# Altium schematic sheet Sheet1.SchDoc
size A4; SheetNumber: 1; SheetTotal: 1
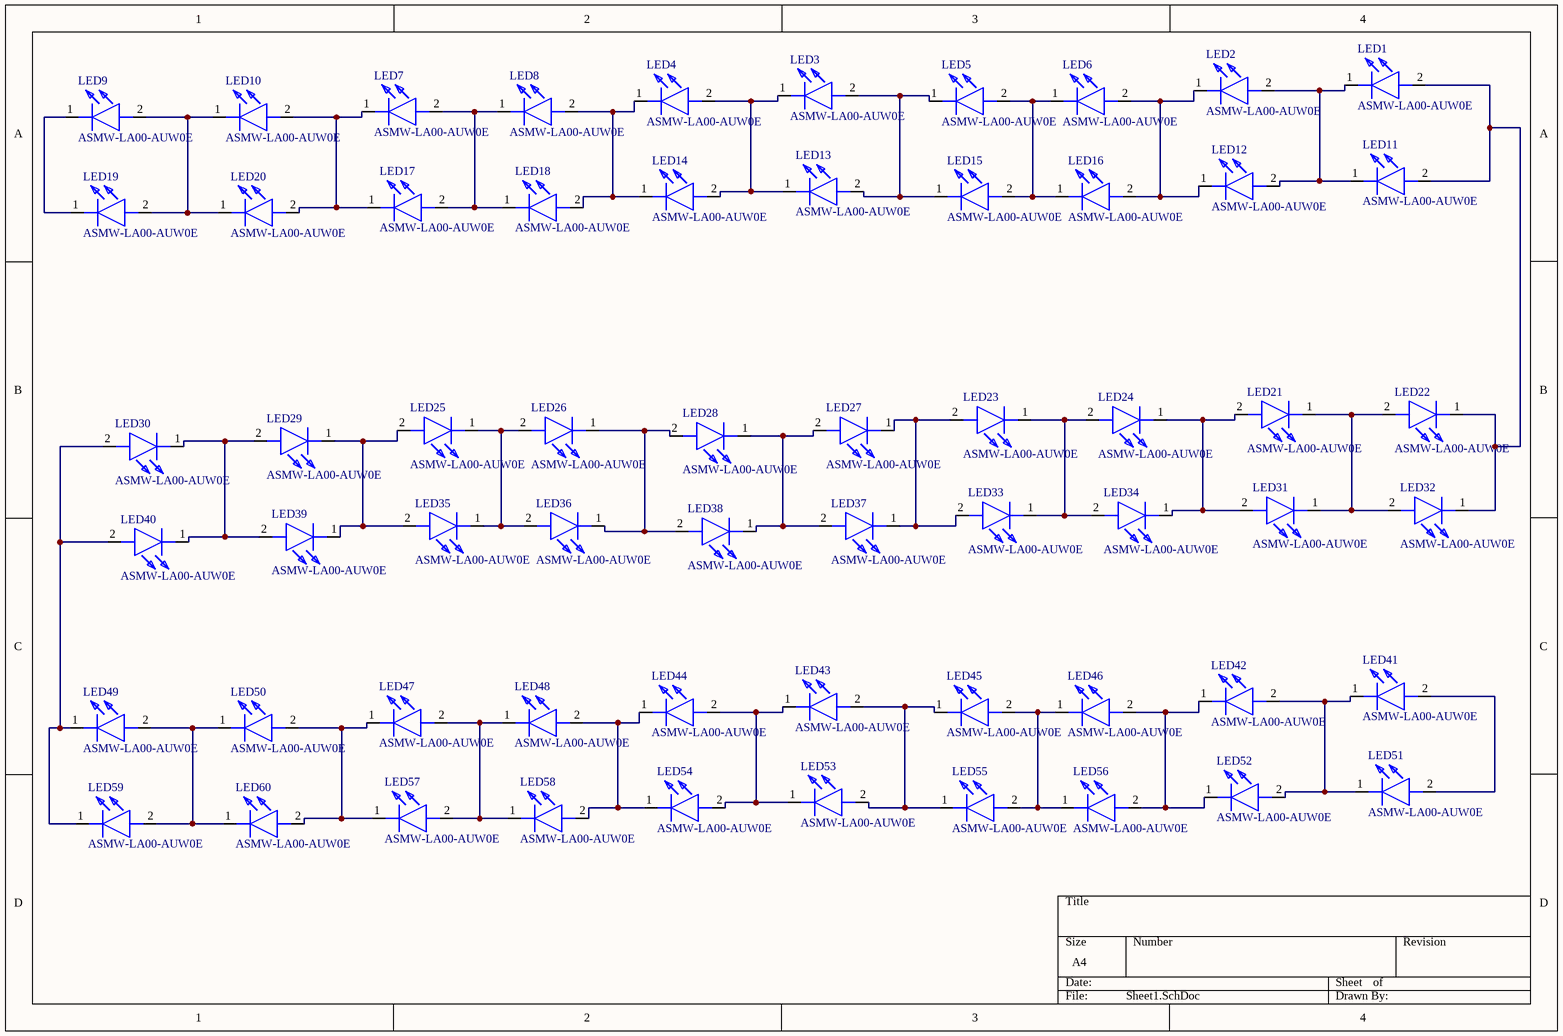
[diagram p0: Sheet1.SchDoc]

## Parts
LED1  ASMW-LA00-AUW0E  [ASMWLA00AUW0E]
LED2  ASMW-LA00-AUW0E  [ASMWLA00AUW0E]
LED3  ASMW-LA00-AUW0E  [ASMWLA00AUW0E]
LED4  ASMW-LA00-AUW0E  [ASMWLA00AUW0E]
LED5  ASMW-LA00-AUW0E  [ASMWLA00AUW0E]
LED6  ASMW-LA00-AUW0E  [ASMWLA00AUW0E]
LED7  ASMW-LA00-AUW0E  [ASMWLA00AUW0E]
LED8  ASMW-LA00-AUW0E  [ASMWLA00AUW0E]
LED9  ASMW-LA00-AUW0E  [ASMWLA00AUW0E]
LED10  ASMW-LA00-AUW0E  [ASMWLA00AUW0E]
LED11  ASMW-LA00-AUW0E  [ASMWLA00AUW0E]
LED12  ASMW-LA00-AUW0E  [ASMWLA00AUW0E]
LED13  ASMW-LA00-AUW0E  [ASMWLA00AUW0E]
LED14  ASMW-LA00-AUW0E  [ASMWLA00AUW0E]
LED15  ASMW-LA00-AUW0E  [ASMWLA00AUW0E]
LED16  ASMW-LA00-AUW0E  [ASMWLA00AUW0E]
LED17  ASMW-LA00-AUW0E  [ASMWLA00AUW0E]
LED18  ASMW-LA00-AUW0E  [ASMWLA00AUW0E]
LED19  ASMW-LA00-AUW0E  [ASMWLA00AUW0E]
LED20  ASMW-LA00-AUW0E  [ASMWLA00AUW0E]
LED21  ASMW-LA00-AUW0E  [ASMWLA00AUW0E]
LED22  ASMW-LA00-AUW0E  [ASMWLA00AUW0E]
LED23  ASMW-LA00-AUW0E  [ASMWLA00AUW0E]
LED24  ASMW-LA00-AUW0E  [ASMWLA00AUW0E]
LED25  ASMW-LA00-AUW0E  [ASMWLA00AUW0E]
LED26  ASMW-LA00-AUW0E  [ASMWLA00AUW0E]
LED27  ASMW-LA00-AUW0E  [ASMWLA00AUW0E]
LED28  ASMW-LA00-AUW0E  [ASMWLA00AUW0E]
LED29  ASMW-LA00-AUW0E  [ASMWLA00AUW0E]
LED30  ASMW-LA00-AUW0E  [ASMWLA00AUW0E]
LED31  ASMW-LA00-AUW0E  [ASMWLA00AUW0E]
LED32  ASMW-LA00-AUW0E  [ASMWLA00AUW0E]
LED33  ASMW-LA00-AUW0E  [ASMWLA00AUW0E]
LED34  ASMW-LA00-AUW0E  [ASMWLA00AUW0E]
LED35  ASMW-LA00-AUW0E  [ASMWLA00AUW0E]
LED36  ASMW-LA00-AUW0E  [ASMWLA00AUW0E]
LED37  ASMW-LA00-AUW0E  [ASMWLA00AUW0E]
LED38  ASMW-LA00-AUW0E  [ASMWLA00AUW0E]
LED39  ASMW-LA00-AUW0E  [ASMWLA00AUW0E]
LED40  ASMW-LA00-AUW0E  [ASMWLA00AUW0E]
LED41  ASMW-LA00-AUW0E  [ASMWLA00AUW0E]
LED42  ASMW-LA00-AUW0E  [ASMWLA00AUW0E]
LED43  ASMW-LA00-AUW0E  [ASMWLA00AUW0E]
LED44  ASMW-LA00-AUW0E  [ASMWLA00AUW0E]
LED45  ASMW-LA00-AUW0E  [ASMWLA00AUW0E]
LED46  ASMW-LA00-AUW0E  [ASMWLA00AUW0E]
LED47  ASMW-LA00-AUW0E  [ASMWLA00AUW0E]
LED48  ASMW-LA00-AUW0E  [ASMWLA00AUW0E]
LED49  ASMW-LA00-AUW0E  [ASMWLA00AUW0E]
LED50  ASMW-LA00-AUW0E  [ASMWLA00AUW0E]
LED51  ASMW-LA00-AUW0E  [ASMWLA00AUW0E]
LED52  ASMW-LA00-AUW0E  [ASMWLA00AUW0E]
LED53  ASMW-LA00-AUW0E  [ASMWLA00AUW0E]
LED54  ASMW-LA00-AUW0E  [ASMWLA00AUW0E]
LED55  ASMW-LA00-AUW0E  [ASMWLA00AUW0E]
LED56  ASMW-LA00-AUW0E  [ASMWLA00AUW0E]
LED57  ASMW-LA00-AUW0E  [ASMWLA00AUW0E]
LED58  ASMW-LA00-AUW0E  [ASMWLA00AUW0E]
LED59  ASMW-LA00-AUW0E  [ASMWLA00AUW0E]
LED60  ASMW-LA00-AUW0E  [ASMWLA00AUW0E]

## Nets
NetLED1_1: LED1.1(K) LED2.2(A) LED11.1(K) LED12.2(A)
NetLED1_2: LED1.2(A) LED11.2(A) LED22.1(K) LED32.1(K)
NetLED2_1: LED2.1(K) LED6.2(A) LED12.1(K) LED16.2(A)
NetLED3_1: LED3.1(K) LED4.2(A) LED13.1(K) LED14.2(A)
NetLED3_2: LED3.2(A) LED5.1(K) LED13.2(A) LED15.1(K)
NetLED4_1: LED4.1(K) LED8.2(A) LED14.1(K) LED18.2(A)
NetLED5_2: LED5.2(A) LED6.1(K) LED15.2(A) LED16.1(K)
NetLED7_1: LED7.1(K) LED10.2(A) LED17.1(K) LED20.2(A)
NetLED7_2: LED7.2(A) LED8.1(K) LED17.2(A) LED18.1(K)
NetLED9_1: LED9.1(K) LED19.1(K)
NetLED9_2: LED9.2(A) LED10.1(K) LED19.2(A) LED20.1(K)
NetLED21_1: LED21.1(K) LED22.2(A) LED31.1(K) LED32.2(A)
NetLED21_2: LED21.2(A) LED24.1(K) LED31.2(A) LED34.1(K)
NetLED23_1: LED23.1(K) LED24.2(A) LED33.1(K) LED34.2(A)
NetLED23_2: LED23.2(A) LED27.1(K) LED33.2(A) LED37.1(K)
NetLED25_1: LED25.1(K) LED26.2(A) LED35.1(K) LED36.2(A)
NetLED25_2: LED25.2(A) LED29.1(K) LED35.2(A) LED39.1(K)
NetLED26_1: LED26.1(K) LED28.2(A) LED36.1(K) LED38.2(A)
NetLED27_2: LED27.2(A) LED28.1(K) LED37.2(A) LED38.1(K)
NetLED29_2: LED29.2(A) LED30.1(K) LED39.2(A) LED40.1(K)
NetLED30_2: LED30.2(A) LED40.2(A) LED49.1(K) LED59.1(K)
NetLED41_1: LED41.1(K) LED42.2(A) LED51.1(K) LED52.2(A)
NetLED41_2: LED41.2(A) LED51.2(A)
NetLED42_1: LED42.1(K) LED46.2(A) LED52.1(K) LED56.2(A)
NetLED43_1: LED43.1(K) LED44.2(A) LED53.1(K) LED54.2(A)
NetLED43_2: LED43.2(A) LED45.1(K) LED53.2(A) LED55.1(K)
NetLED44_1: LED44.1(K) LED48.2(A) LED54.1(K) LED58.2(A)
NetLED45_2: LED45.2(A) LED46.1(K) LED55.2(A) LED56.1(K)
NetLED47_1: LED47.1(K) LED50.2(A) LED57.1(K) LED60.2(A)
NetLED47_2: LED47.2(A) LED48.1(K) LED57.2(A) LED58.1(K)
NetLED49_2: LED49.2(A) LED50.1(K) LED59.2(A) LED60.1(K)

## Library data of the parts
LED1-LED60 = ASMW-LA00-AUW0E: LED; Manufacturer_Name: Avago Technologies; Datasheet Link: https://docs.broadcom.com/docs/ASMW-LXXX-DS100; Height: 0.9mm; Manufacturer_Part_Number: ASMW-LA00-AUW0E; Mouser Part Number: 630-ASMW-LA00-AUW0E; Mouser Price/Stock: https://www.mouser.co.uk/ProductDetail/Broadcom-Avago/ASMW-LA00-AUW0E?qs=Mv7BduZupUh3TD%252BqME6K1Q%3D%3D